# Altium schematic sheet AFE.SchDoc
size A4; SheetNumber: 1; SheetTotal: 2
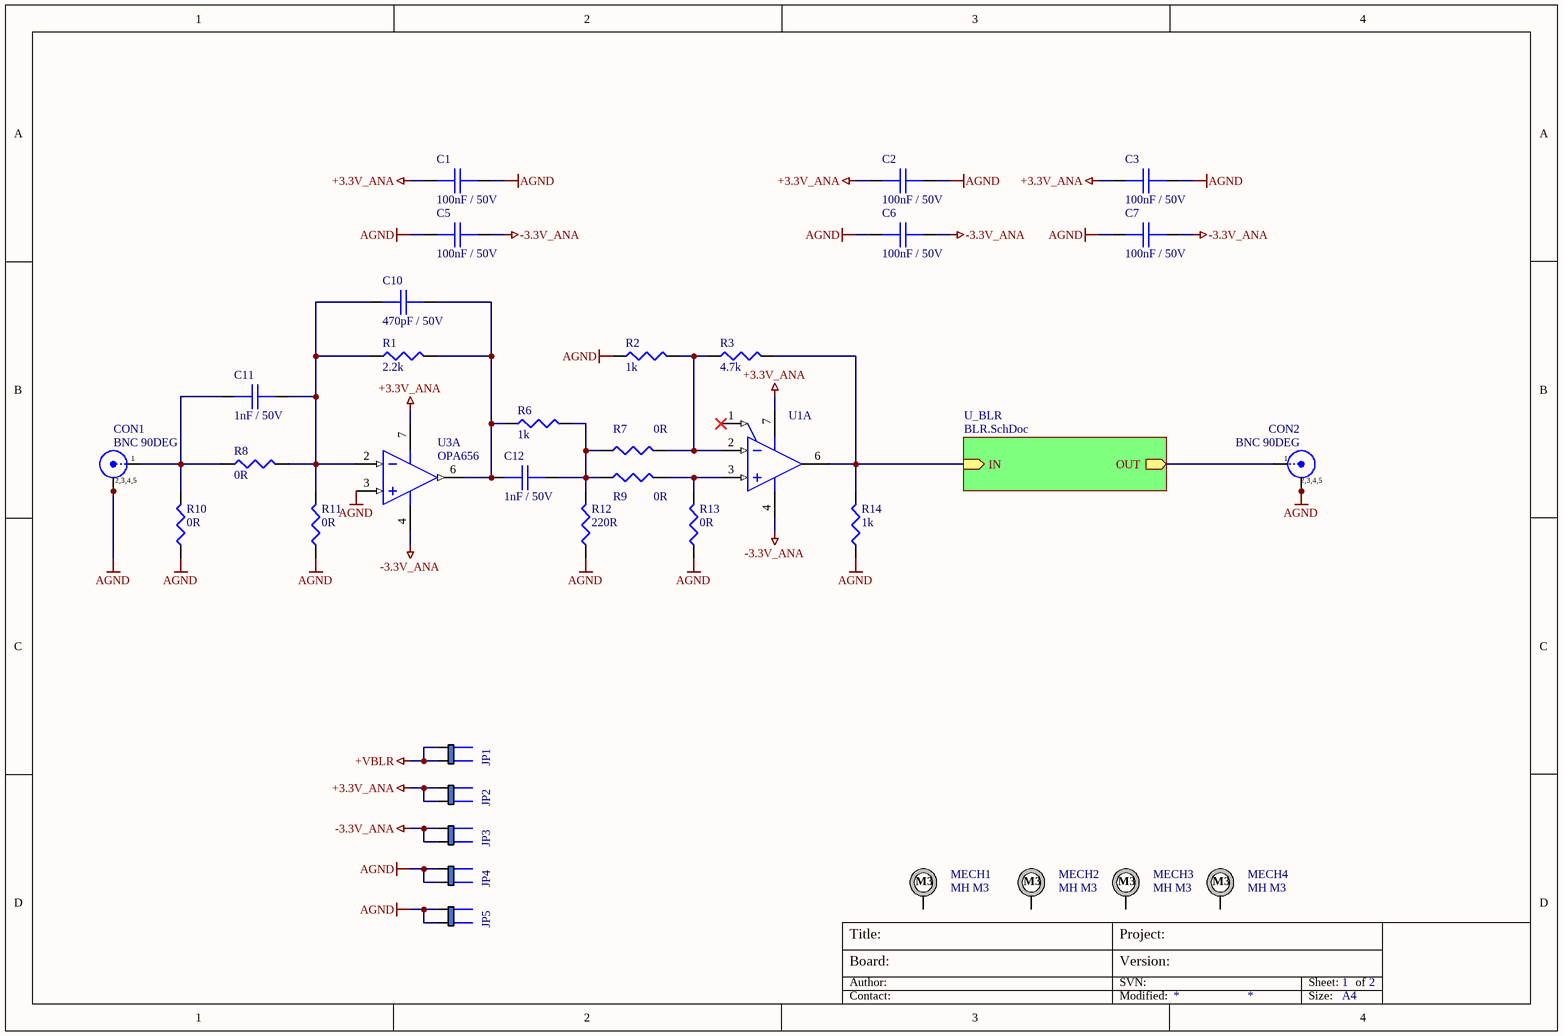
[diagram p0: AFE.SchDoc]

## Parts
C1  100nF / 50V  [1206_C]
C2  100nF / 50V  [1206_C]
C3  100nF / 50V  [1206_C]
C5  100nF / 50V  [1206_C]
C6  100nF / 50V  [1206_C]
C7  100nF / 50V  [1206_C]
C10  470pF / 50V  [1206_C]
C11  1nF / 50V  [0805_C]
C12  1nF / 50V  [0603_C]
CON1  BNC 90DEG  [CON_BNC_TE_ZDC]
CON2  BNC 90DEG  [CON_BNC_TE_ZDC]
JP1  JUMPER2 2.54MM  [JUMPER_5]  (value not drawn)
JP2  JUMPER2 2.54MM  [JUMPER_5]  (value not drawn)
JP3  JUMPER2 2.54MM  [JUMPER_5]  (value not drawn)
JP4  JUMPER2 2.54MM  [JUMPER_5]  (value not drawn)
JP5  JUMPER2 2.54MM  [JUMPER_5]  (value not drawn)
MECH1  MH M3  [PAD_M3 x 7]  (no BOM)
MECH2  MH M3  [PAD_M3 x 7]  (no BOM)
MECH3  MH M3  [PAD_M3 x 7]  (no BOM)
MECH4  MH M3  [PAD_M3 x 7]  (no BOM)
R1  2.2k  [1206]
R2  1k  [1206]
R3  4.7k  [1206]
R6  1k  [1206]
R7  0R  [1206]
R8  0R  [1206]
R9  0R  [1206]
R10  0R  [1206]
R11  0R  [1206]
R12  220R  [0603]
R13  0R  [1206]
R14  1k  [1206]
U1  LT1806CS8#PBF  [SO-8]  (value not drawn)  (part A of 2)
U3  OPA656  [SO-8]  (part A of 2)

## Sub-sheets
U_BLR = BLR.SchDoc: IN (in), OUT (out)

## Nets
+3.3V_ANA: C1.1 C2.1 C3.1 JP2.1 JP2.2 U1.7(V+) U3.7(VS+)
+VBLR: JP1.1 JP1.2
-3.3V_ANA: C5.2 C6.2 C7.2 JP3.1 JP3.2 U1.4(V-) U3.4(VS-)
AGND: C1.2 C2.2 C3.2 C5.1 C6.1 C7.1 CON1.2 CON1.3 CON1.4 CON1.5 CON2.2 CON2.3 CON2.4 CON2.5 JP4.1 JP4.2 JP5.1 JP5.2 R2.1 R10.1 R11.1 R12.1 R13.1 R14.1 U3.3(IN+)
NetC10_1: C10.1 C12.1 R1.1 R6.1 U3.6(OUT)
NetC10_2: C10.2 C11.2 R1.2 R8.2 R11.2 U3.2(IN-)
NetC11_1: C11.1 CON1.1 R8.1 R10.2
NetC12_2: C12.2 R6.2 R7.1 R9.1 R12.2
NetCON2_1: CON2.1 ; sheet U_BLR/OUT
NetR2_2: R2.2 R3.1 R7.2 U1.2(-IN)
NetR3_2: R3.2 R14.2 U1.6(OUT) ; sheet U_BLR/IN
NetR9_2: R9.2 R13.2 U1.3(+IN)

Not connected (* = marked no-connect by the designer): MECH1 M3; MECH2 M3; MECH3 M3; MECH4 M3; U1 1(~{SHDN})*

## Notes on the sheet
- Board:
- Author:
- Title:
- Project:
- SVN:
- Version:
- Sheet:
- of
- Contact:
- Modified:
- Size:
- A4
- (in symbol 322) 2,3,4,5

## Library data of the parts
C1-C3 C5-C7 = 163: 100nF 50V X7R; Part Number: SMD1206-100nF-50V; Azonosító: 163; Category: Passives; Subcategory: PASS_Capacitor; Supplier 1: HESTORE; Supplier 1 order number: 100.002.89
C10 = 159: 470pF 50V C0G; Part Number: SMD1206-470pF-50V; Azonosító: 159; Category: Passives; Subcategory: PASS_Capacitor; Supplier 1: HESTORE; Supplier 1 order number: 100.201.00
C11 = 144: 1nF 50V X7R; Part Number: SMD0805-1nF-50V; Azonosító: 144; Category: Passives; Subcategory: PASS_Capacitor; Supplier 1: HESTORE; Supplier 1 order number: 100.200.70
C12 = 121: 1 nF 50V X7R; Part Number: SMD0603-1nF-50V; Azonosító: 121; Category: Passives; Subcategory: PASS_Capacitor; Supplier 1: HESTORE; Supplier 1 order number: 100.277.92
CON1 CON2 = 322: 031-5431; Azonosító: 322; Part Number: BNC 90DEG; Category: Connectors; Subcategory: CONN_Board-to-Wire; Supplier 1: MOUSER; Supplier 1 order number: 523-31-5431; Help URL: https://hu.mouser.com/datasheet/2/18/1/C031_5431-2452407.pdf
JP1-JP5 = 246: Azonosító: 246; Part Number: JUMPER2 2.54MM; Category: Connectors; Subcategory: CONN_Other; Supplier 1: FARNELL; Supplier 1 order number: 2356153
MECH1-MECH4 = 268: 3.2/7mm Mounting_Hole_M3; Azonosító: 268; Part Number: Mounting_Hole_M3; Category: Electro-mechanicals; Subcategory: ELME_Other
R1 = 88: 2.2k 1206 0.25W 5%; Part Number: SMD1206-2.2k 5%; Azonosító: 88; Category: Passives; Subcategory: PASS_Resistor; Supplier 1: HESTORE; Supplier 1 order number: 100.002.94
R2 R6 R14 = 87: 1k 1206 0.25W 5%; Part Number: SMD1206-1k 5%; Azonosító: 87; Category: Passives; Subcategory: PASS_Resistor; Supplier 1: HESTORE; Supplier 1 order number: 100.002.56
R3 = 90: 4.7k 1206 0.25W 5%; Part Number: SMD1206-4.7k 5%; Azonosító: 90; Category: Passives; Subcategory: PASS_Resistor; Supplier 1: HESTORE; Supplier 1 order number: 100.002.99
R7-R11 R13 = 74: 0R 1206 0.25W 5%; Part Number: SMD1206-0R 5%; Azonosító: 74; Category: Passives; Subcategory: PASS_Resistor; Supplier 1: HESTORE; Supplier 1 order number: 100.013.21
R12 = 14: 220R 0603 0.1W 1%; Part Number: SMD0603-220R-1%; Azonosító: 14; Category: Passives; Subcategory: PASS_Resistor; Supplier 1: HESTORE; Supplier 1 order number: 100.368.36
U1 = 353: Single Channel, High Speed, Low Noise Precision Operational Amplifier, 325 MHz Typical GBW, 125 V/us Typical SR, 2.5 to 12.6 V, 8-Pin SOIC; Manufacturer: Linear Technology; Linear Technology Part Number: LT1806; Is (mA) Typical: 9; GBW (MHz) Typical: 325; SR (V/us) Typical: 125; Vos (mV) Guaranteed: 0.55; Vos (mV) Typical: 0.1; Vs Max (V): 12.6; Vs Min (V): 2.5; Channels (#): 1; Azonosító: 353; DatasheetVersion: Rev. C; ComponentLink3Description: Package Specification; Mounting Technology: Surface Mount; ComponentLink2Description: Datasheet; RevisionNote: URLs updated; PackageDescription: 8-Pin Plastic Small Outline, Body 4.9 x 3.9 mm, Pitch 1.27 mm; PackageVersion: Rev G; RoHS: Pb-Free; Type: VFB; PackageReference: LT-S8-8; ComponentLink2URL: http://cds.linear.com/docs/en/datasheet/18067fc.pdf; ComponentLink3URL: http://cds.linear.com/docs/en/packaging/05081610_G_SO8.pdf; PartNumber: LT1806CS8#PBF; ComponentLink1Description: Manufacturer URL; ComponentLink1URL: http://www.linear.com/; Part Number: LT1806CS8#PBF; Category: Integrated Circuits; Subcategory: IC_Analog; Supplier 1: MOUSER; Supplier 1 order number: 584-LT1806CS8#PBF; Help URL: https://hu.mouser.com/datasheet/2/609/18067fc-3124195.pdf
U3 = 357: Wideband, Unity Gain Stable FET-Input Operational Amplifier, 10 to 12 V, -40 to 85 degC, 8-pin SOIC; PartNumber: OPA656U; Manufacturer: Texas Instruments; BW @ Acl(MHz): 500; Acl, min stable gain(V/V): 1; THD (Fc is 1 MHz)(Typ)(dB): -74; Io(Typ)(mA): 70; @ MHz: 5; Vn at Flatband(Typ)(nV/rtHz): 7; 3rd Harmonic(dBc): 100; Slew Rate(Typ)(V/us): 290; 2nd Harmonic(dBc): 74; Vs(Min)(V): 10; Vs(Max)(V): 12; Iib(Max)(nA): 0.02; Settling Time (0.1%)(Typ)(ns): 16; Vio(Max)(mV): 0.6; Diff Phase(deg): 0.05; Eco-Plan: Green (RoHS & no Sb/Br); Sub Family: High Output Current Amplifier (>=50mA), High Speed Amplifier (>=50MHz), Low Input Bias Current Amp (<=10pA); Azonosító: 357; ComponentLink1URL: http://www.ti.com/; ComponentLink2URL: http://www.ti.com/general/docs/lit/getliterature.tsp?genericPartNumber=OPA656&fileType=pdf; Mounting Technology: Surface Mount; Code_JEDEC: MS-012; PackageReference: D0008A; ComponentLink3URL: http://www.ti.com/litv/pdf/msoi002j; PackageVersion: 4040047-3/M, 06/2011; ComponentLink3Description: Package Specification; Number of Channels: 1; DatasheetVersion: SBOS196G; Iq per channel(Max)(mA): 16; ComponentLink2Description: Datasheet; ComponentLink1Description: Manufacturer URL; Diff Gain(%): 0.02; PackageDescription: 8-Pin Plastic Small Outline, Body 4.9 x 3.9 mm, Pitch 1.27 mm; Part Number: OPA656; Category: Integrated Circuits; Subcategory: IC_Analog; Supplier 1: MOUSER; Supplier 1 order number: 595-OPA656U; Supplier 2: DIGIKEY; Supplier 2 order number: OPA656U-ND; Help URL: https://www.ti.com/lit/ds/symlink/opa656.pdf?HQS=dis-mous-null-mousermode-dsf-pf-null-wwe&ts=1703783263659&ref_url=https%253A%252F%252Fhu.mouser.com%252F